# EAGLE design Keypad Interface (EAGLE 5.11)
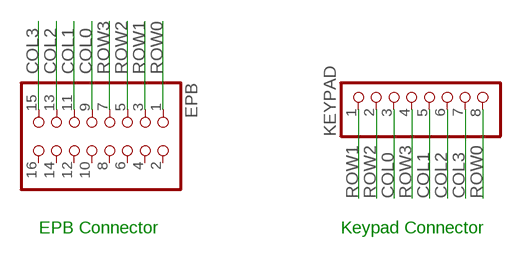
[diagram p0: schematic, sheet 1]

## Parts
EPB  PINHD-2X8  [2X08]
KEYPAD  PINHD-1X8  [1X08]

## Nets
COL0: EPB.9 KEYPAD.3
COL1: EPB.11 KEYPAD.5
COL2: EPB.13 KEYPAD.6
COL3: EPB.15 KEYPAD.7
ROW0: EPB.1 KEYPAD.8
ROW1: EPB.3 KEYPAD.1
ROW2: EPB.5 KEYPAD.2
ROW3: EPB.7 KEYPAD.4
Unconnected: EPB.2 EPB.4 EPB.6 EPB.8 EPB.10 EPB.12 EPB.14 EPB.16

## Notes on the sheet
- EPB Connector | Keypad Connector

## Library data of the parts
EPB = pinhead:PINHD-2X8: PIN HEADER
KEYPAD = pinhead:PINHD-1X8: PIN HEADER

## Board
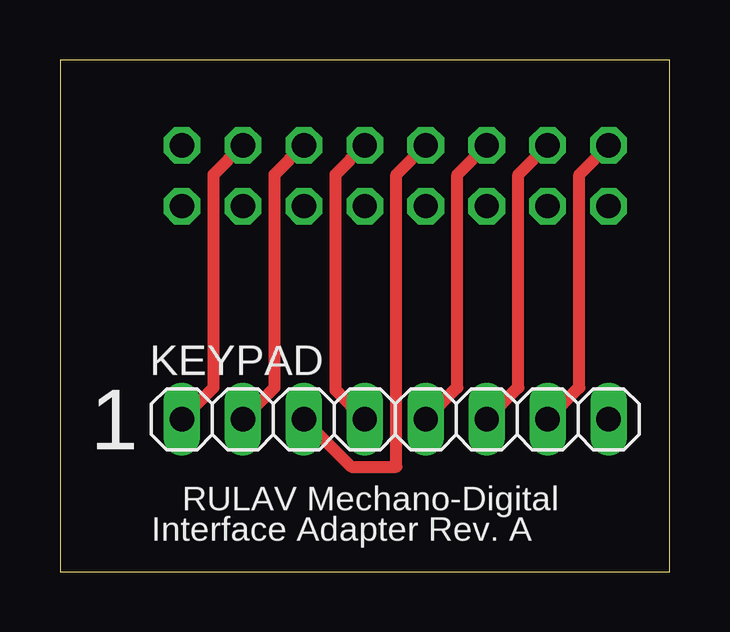
[diagram p1: board, top side]
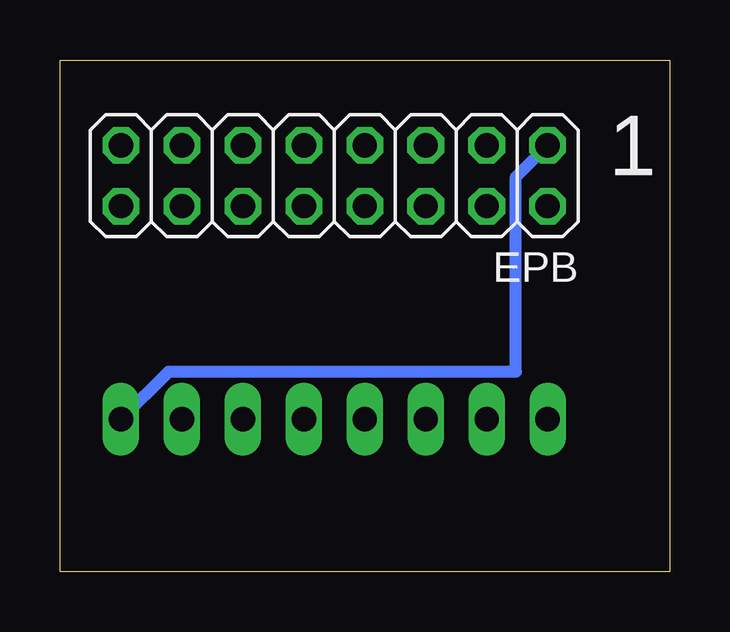
[diagram p2: board, bottom side, seen from below]

Size 25.4 x 21.34 mm. Coordinates in mm from the lower left corner, seen from the top.
Outline: 0,0 25.4,0 25.4,21.34 0,21.34 0,0
Copper layers (1*16): Top 0.035mm / dielectric 1.5mm / Bottom 0.035mm
Design rules "default *": minimum track width 20mil, minimum drill 24mil, track to track 8mil, track to pad 8mil, pad to pad 8mil, via to via 8mil, smd to smd 8mil, copper to edge 40mil, drill to drill 8mil, minimum pad ring 10mil, minimum via ring 8mil, stop-mask expansion 4mil, vias tented up to drill 0mil, thermal gap 10mil

### Footprints (pad centres in the part's own frame; a part is rotated, then mirrored left to right if it is on the bottom)
2X08 = drill 1.016 octagon: 1 -8.89,-1.27; 2 -8.89,1.27; 3 -6.35,-1.27; 4 -6.35,1.27; 5 -3.81,-1.27; 6 -3.81,1.27; 7 -1.27,-1.27; 8 -1.27,1.27; 9 1.27,-1.27; 10 1.27,1.27; 11 3.81,-1.27; 12 3.81,1.27; 13 6.35,-1.27; 14 6.35,1.27; 15 8.89,-1.27; 16 8.89,1.27
1X08 = drill 1.016 long: 1 -8.89,0; 2 -6.35,0; 3 -3.81,0; 4 -1.27,0; 5 1.27,0; 6 3.81,0; 7 6.35,0; 8 8.89,0

### Placement (x,y rotation side)
EPB  13.97,16.51 180 bottom
KEYPAD  13.97,6.35 0 top

### Tracks (layer width: path | path; a pad name or v marks a point on that pad's centre or on a via)
COL0
  Top 0.508: KEYPAD.3 12.14,4.37 14.02,4.37 14.02,16.56 EPB.9
COL1
  Top 0.508: KEYPAD.5 16.56,7.67 16.56,16.56 EPB.11
COL2
  Top 0.508: KEYPAD.6 19.1,7.67 19.1,16.56 EPB.13
COL3
  Top 0.508: KEYPAD.7 21.64,7.67 21.64,16.56 EPB.15
ROW0
  Bottom 0.508: EPB.1 6.4,16.46 6.4,8.33 20.88,8.33 KEYPAD.8
ROW1
  Top 0.508: KEYPAD.1 6.4,7.67 6.4,16.56 EPB.3
ROW2
  Top 0.508: KEYPAD.2 8.94,7.67 8.94,16.56 EPB.5
ROW3
  Top 0.508: KEYPAD.4 11.48,7.57 11.48,16.56 EPB.7

### Text on the board
tNames: 1 | RULAV Mechano-Digital | Interface Adapter Rev. A
bNames: 1